# Altium schematic sheet ANALOG_INPUT_CTRL.SchDoc: Analog Input Control
size A3; DocumentNumber: 4; SheetNumber: 4; SheetTotal: 12
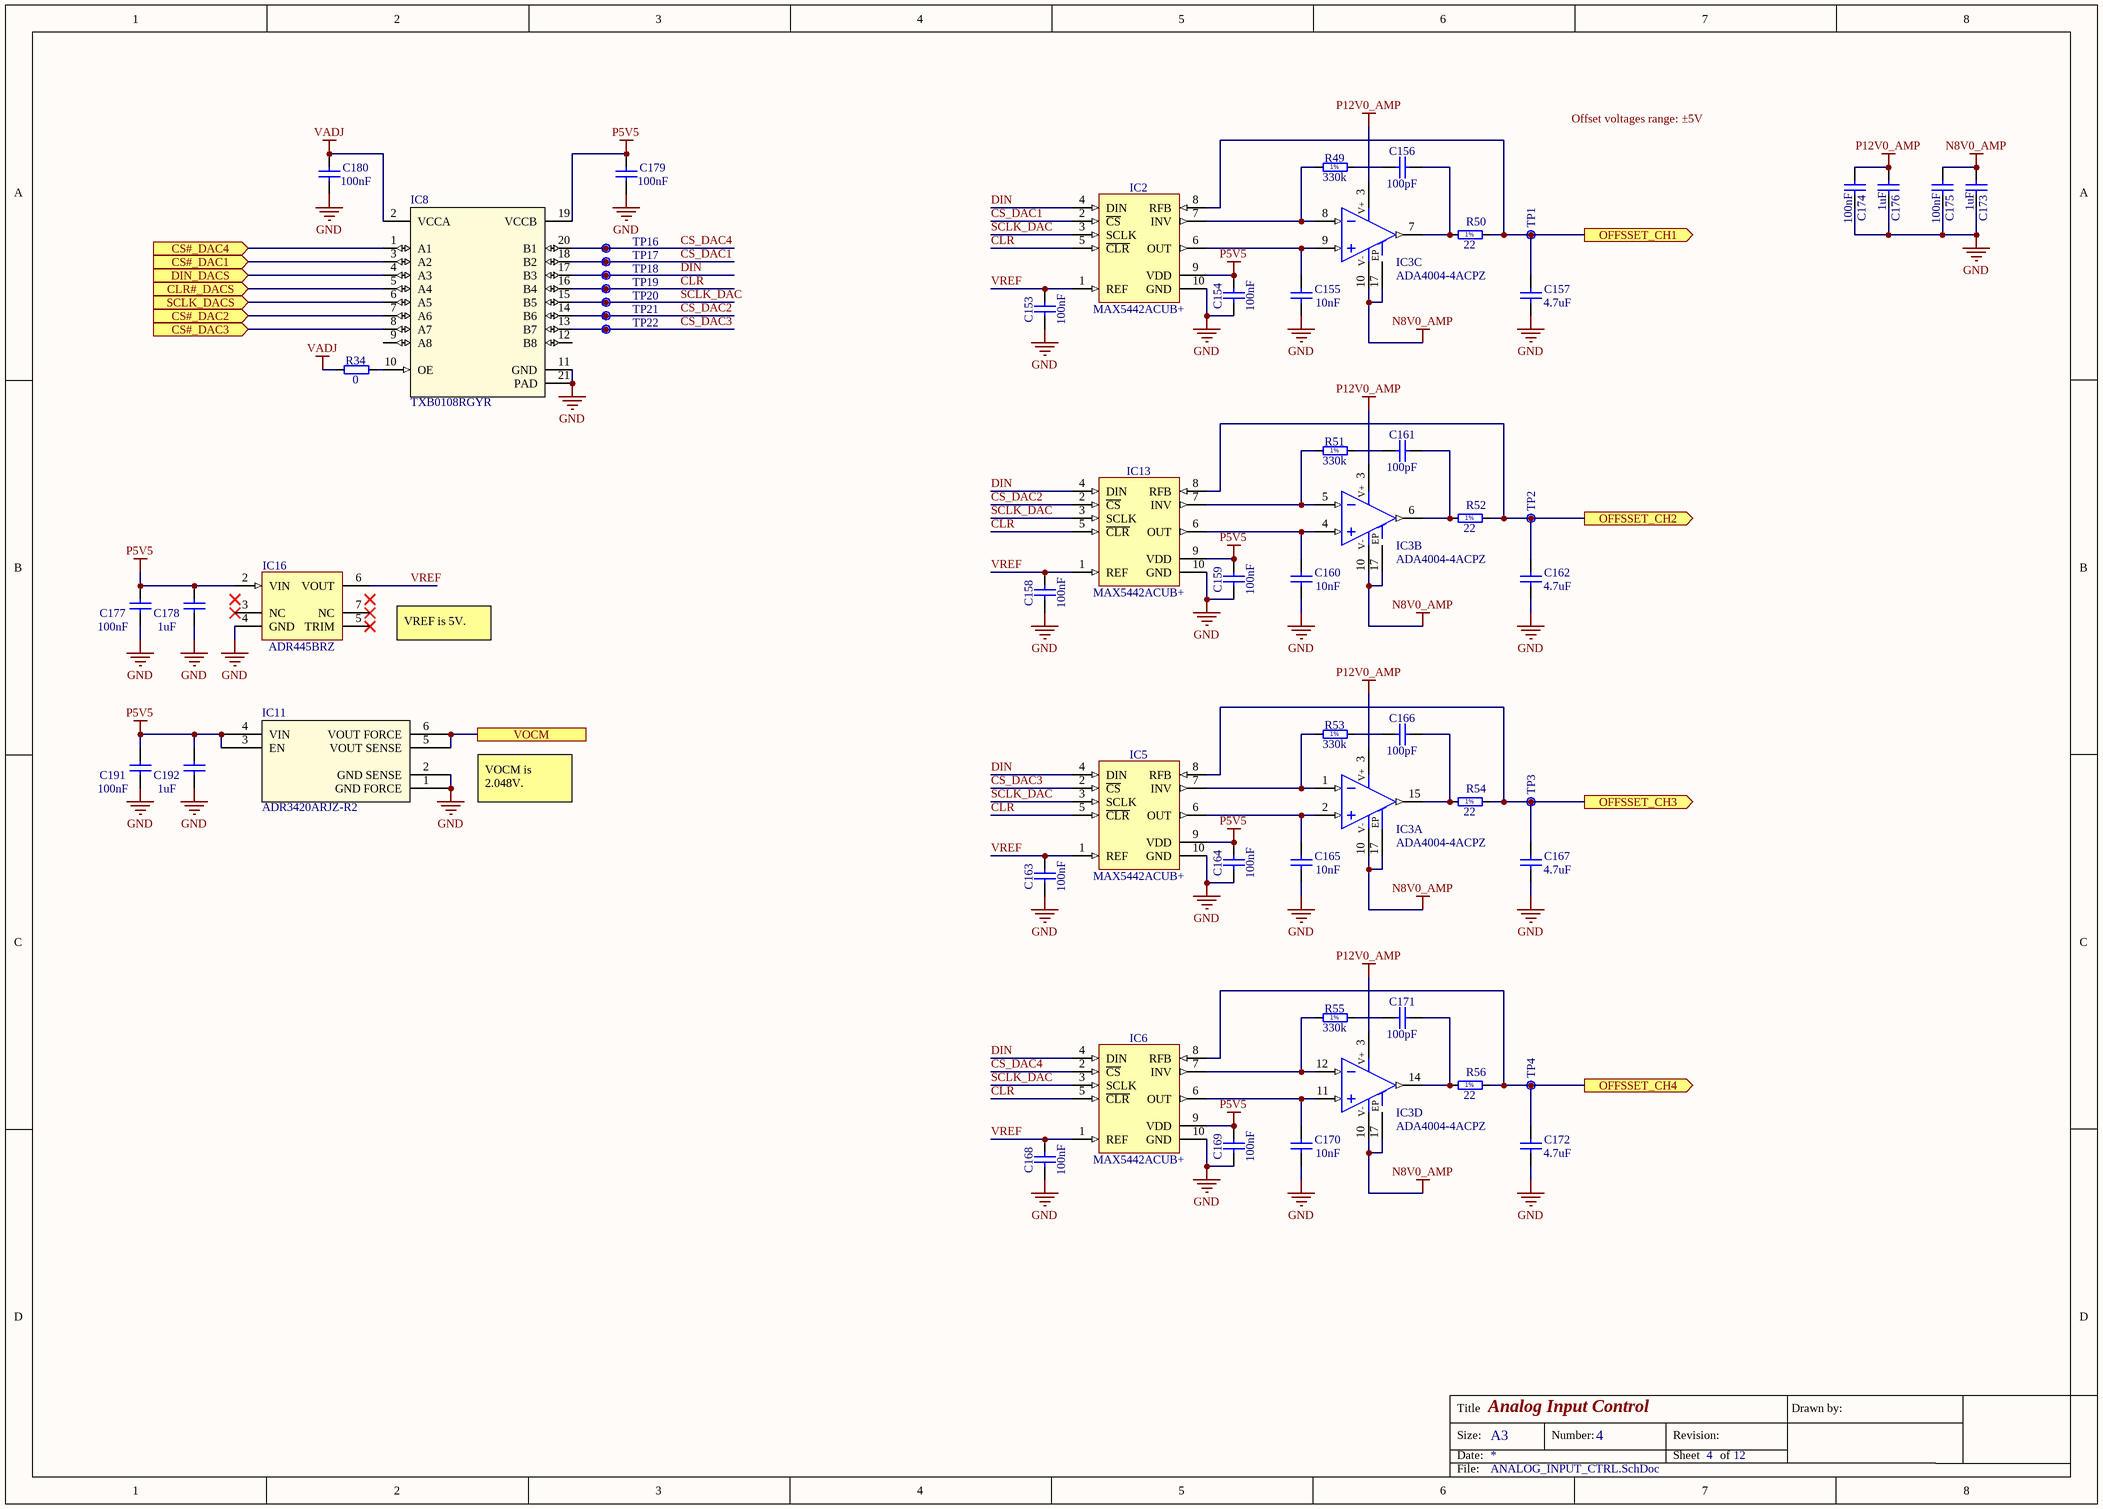
[diagram p0: ANALOG_INPUT_CTRL.SchDoc]

## Parts
C153  100nF  [CAPC1005X55N]
C154  100nF  [CAPC1005X55N]
C155  10nF  [CAPC1608X87N]
C156  100pF  [CAPC1608X87N]
C157  4.7uF  [CAPC2012X135N]
C158  100nF  [CAPC1005X55N]
C159  100nF  [CAPC1005X55N]
C160  10nF  [CAPC1608X87N]
C161  100pF  [CAPC1608X87N]
C162  4.7uF  [CAPC2012X135N]
C163  100nF  [CAPC1005X55N]
C164  100nF  [CAPC1005X55N]
C165  10nF  [CAPC1608X87N]
C166  100pF  [CAPC1608X87N]
C167  4.7uF  [CAPC2012X135N]
C168  100nF  [CAPC1005X55N]
C169  100nF  [CAPC1005X55N]
C170  10nF  [CAPC1608X87N]
C171  100pF  [CAPC1608X87N]
C172  4.7uF  [CAPC2012X135N]
C173  1uF  [CAPC1608X87N]
C174  100nF  [CAPC1608X87N]
C175  100nF  [CAPC1608X87N]
C176  1uF  [CAPC1608X87N]
C177  100nF  [CAPC1005X55N]
C178  1uF  [CAPC1608X87N]
C179  100nF  [CAPC0603X33N]
C180  100nF  [CAPC0603X33N]
C191  100nF  [CAPC1005X55N]
C192  1uF  [CAPC1608X87N]
IC2  MAX5442ACUB+  [SOP50P490X110-10N]
IC3  ADA4004-4ACPZ  [QFN65P400X400X100-17N-S225]  (parts A,B,C,D of 4)
IC5  MAX5442ACUB+  [SOP50P490X110-10N]
IC6  MAX5442ACUB+  [SOP50P490X110-10N]
IC8  TXB0108RGYR  [RGY20_3P05x2P05]
IC11  ADR3420ARJZ-R2  [RJ_6]
IC13  MAX5442ACUB+  [SOP50P490X110-10N]
IC16  ADR445BRZ  [SOIC127P600X175-8N]
R34  0  [RESC1005X40N]
R49  330k  [RESC1608X55N]
R50  22  [RESC1608X55N]
R51  330k  [RESC1608X55N]
R52  22  [RESC1608X55N]
R53  330k  [RESC1608X55N]
R54  22  [RESC1608X55N]
R55  330k  [RESC1608X55N]
R56  22  [RESC1608X55N]
TP1  (no value)  [TPS127]
TP2  (no value)  [TPS127]
TP3  (no value)  [TPS127]
TP4  (no value)  [TPS127]
TP16  Test Point  [TPS62]  (value not drawn)
TP17  Test Point  [TPS62]  (value not drawn)
TP18  Test Point  [TPS62]  (value not drawn)
TP19  Test Point  [TPS62]  (value not drawn)
TP20  Test Point  [TPS62]  (value not drawn)
TP21  Test Point  [TPS62]  (value not drawn)
TP22  Test Point  [TPS62]  (value not drawn)

## Ports
CLR#_DACS (in), CS#_DAC1 (in), CS#_DAC2 (in), CS#_DAC3 (in), CS#_DAC4 (in), DIN_DACS (in), OFFSSET_CH1 (out), OFFSSET_CH2 (out), OFFSSET_CH3 (out), OFFSSET_CH4 (out), SCLK_DACS (in), VOCM

## Nets
GND: C153.1 C154.1 C155.1 C157.2 C158.1 C159.1 C160.1 C162.2 C163.1 C164.1 C165.1 C167.2 C168.1 C169.1 C170.1 C172.2 C173.2 C174.2 C175.2 C176.2 C177.1 C178.1 C179.1 C180.1 C191.1 C192.1 IC2.10(GND) IC5.10(GND) IC6.10(GND) IC8.11(GND) IC8.21(PAD) IC11.1(GND_FORCE) IC11.2(GND_SENSE) IC13.10(GND) IC16.4(GND)
N8V0_AMP: C173.1 C175.1 IC3.10(V-) IC3.17(EP)
P5V5: C154.2 C159.2 C164.2 C169.2 C177.2 C178.2 C179.2 C191.2 C192.2 IC2.9(VDD) IC5.9(VDD) IC6.9(VDD) IC8.19(VCCB) IC11.3(EN) IC11.4(VIN) IC13.9(VDD) IC16.2(VIN)
P12V0_AMP: C174.1 C176.1 IC3.3(V+)
VADJ: C180.2 IC8.2(VCCA) R34.1
CLR: IC2.5(~{CLR}) IC5.5(~{CLR}) IC6.5(~{CLR}) IC8.16(B4) IC13.5(~{CLR}) TP19.1
CLR#_DACS: IC8.5(A4) ; port CLR#_DACS
CS#_DAC1: IC8.3(A2) ; port CS#_DAC1
CS#_DAC2: IC8.7(A6) ; port CS#_DAC2
CS#_DAC3: IC8.8(A7) ; port CS#_DAC3
CS#_DAC4: IC8.1(A1) ; port CS#_DAC4
CS_DAC1: IC2.2(~{CS}) IC8.18(B2) TP17.1
CS_DAC2: IC8.14(B6) IC13.2(~{CS}) TP21.1
CS_DAC3: IC5.2(~{CS}) IC8.13(B7) TP22.1
CS_DAC4: IC6.2(~{CS}) IC8.20(B1) TP16.1
DIN: IC2.4(DIN) IC5.4(DIN) IC6.4(DIN) IC8.17(B3) IC13.4(DIN) TP18.1
DIN_DACS: IC8.4(A3) ; port DIN_DACS
OFFSSET_CH1: C157.1 IC2.8(RFB) R50.2 TP1.1 ; port OFFSSET_CH1
OFFSSET_CH2: C162.1 IC13.8(RFB) R52.2 TP2.1 ; port OFFSSET_CH2
OFFSSET_CH3: C167.1 IC5.8(RFB) R54.2 TP3.1 ; port OFFSSET_CH3
OFFSSET_CH4: C172.1 IC6.8(RFB) R56.2 TP4.1 ; port OFFSSET_CH4
SCLK_DAC: IC2.3(SCLK) IC5.3(SCLK) IC6.3(SCLK) IC8.15(B5) IC13.3(SCLK) TP20.1
SCLK_DACS: IC8.6(A5) ; port SCLK_DACS
VOCM: IC11.5(VOUT_SENSE) IC11.6(VOUT_FORCE) ; port VOCM
VREF: C153.2 C158.2 C163.2 C168.2 IC2.1(REF) IC5.1(REF) IC6.1(REF) IC13.1(REF) IC16.6(VOUT)
NetC155_2: C155.2 IC2.6(OUT) IC3.9(IN+)
NetC156_1: C156.1 R49.2
NetC156_2: C156.2 IC3.7(OUT) R50.1
NetC160_2: C160.2 IC3.4(IN+) IC13.6(OUT)
NetC161_1: C161.1 R51.2
NetC161_2: C161.2 IC3.6(OUT) R52.1
NetC165_2: C165.2 IC3.2(IN+) IC5.6(OUT)
NetC166_1: C166.1 R53.2
NetC166_2: C166.2 IC3.15(OUT) R54.1
NetC170_2: C170.2 IC3.11(IN+) IC6.6(OUT)
NetC171_1: C171.1 R55.2
NetC171_2: C171.2 IC3.14(OUT) R56.1
NetIC2_7: IC2.7(INV) IC3.8(IN-) R49.1
NetIC3_1: IC3.1(IN-) IC5.7(INV) R53.1
NetIC3_5: IC3.5(IN-) IC13.7(INV) R51.1
NetIC3_12: IC3.12(IN-) IC6.7(INV) R55.1
NetIC8_10: IC8.10(OE) R34.2

Not connected (* = marked no-connect by the designer): IC8 9(A8) 12(B8); IC16 3(NC)* 5(TRIM)* 7(NC)*

## Notes on the sheet
- Offset voltages range: ±5V
- VREF is 5V.
- VOCM is 2.048V.
- Title
- Size:
- Date:
- A3
- Number:
- Revision:
- Sheet
- of
- Drawn by:
- File:
- (in symbol R0603_22R_1%_0.1W_100PPM) 1%
- (in symbol R0603_330K_1%_0.1W_100PPM) 1%

## Library data of the parts
C153 C154 C158 C159 C163 C164 C168 C169 C177 C191 = CC0402_100NF_16V_10%_X7R: Non-polarised capacitor; Part Description: SMD Multilayer Chip Ceramic Capacitor; Manufacturer: GENERIC; Manufacturer1 Part Number: GRM155R71C104KA88D; Voltage: 16V; TC: X7R; Tolerance: ±10%; Part Number: CC0402_100NF_16V_10%_X7R; Component Kind: Standard; Component Type: Standard; Pin Count: 2; Value: 100nF; Status: Not Recommended; Manufacturer Part Number: CC0402_100NF_16V_10%_X7R; Case: 0402; Mounted: Yes; Socket: No; SMD: Yes; Sense: No; Manufacturer1 Example: MURATA; Manufacturer1 ComponentHeight: 0.55mm; HelpURL: \\cern.ch\dfs\Applications\Altium\Datasheets\CC0402_X7R_MURATA_GRM.pdf; Author: CERN DEM JLC; CreateDate: 05.12.2013; LatestRevisionDate: 03.12.2007
C155 C160 C165 C170 = CC0603_10NF_50V_10%_X7R: Non-polarised capacitor; Manufacturer1 Part Number: 223858615636; Manufacturer: GENERIC; Part Description: SMD Multilayer Chip Ceramic Capacitor; TC: X7R; Tolerance: ±10%; Voltage: 50V; Author: CERN DEM JLC; Case: 0603; Component Type: Standard; CreateDate: 03.12.2007; HelpURL: \\cern.ch\dfs\Applications\Altium\Datasheets\CC0603_X7R_PHYCOMP.pdf; LatestRevisionDate: 03.12.2007; Manufacturer1 ComponentHeight: 0.87mm; Manufacturer1 Example: PHYCOMP; Manufacturer Part Number: CC0603_10NF_50V_10%_X7R; Mounted: Yes; Pin Count: 2; SMD: Yes; Socket: No; Status: Preferred; Value: 10nF; Part Number: CC0603_10NF_50V_10%_X7R; Component Kind: Standard; Sense: No
C156 C161 C166 C171 = CC0603_100PF_50V_5%_NP0: Non-polarised capacitor; Part Description: SMD Multilayer Chip Ceramic Capacitor; Manufacturer: GENERIC; Manufacturer1 Part Number: 223886715101; Voltage: 50V; TC: C0G/NP0; Tolerance: ±5%; Part Number: CC0603_100PF_50V_5%_NP0; Component Kind: Standard; Component Type: Standard; Pin Count: 2; Value: 100pF; Status: Preferred; Manufacturer Part Number: CC0603_100PF_50V_5%_NP0; Case: 0603; Mounted: Yes; Socket: No; SMD: Yes; Manufacturer1 Example: PHYCOMP; Manufacturer1 ComponentHeight: 0.87mm; HelpURL: \\cern.ch\dfs\Applications\Altium\Datasheets\CC0603_NP0_PHYCOMP.pdf; Author: CERN DEM JLC; CreateDate: 03.12.2007; LatestRevisionDate: 03.12.2007; Sense: No
C157 C162 C167 C172 = CC0805_4.7UF_16V_10%_X7R: Non-polarised capacitor; Part Description: SMD Multilayer Chip Ceramic Capacitor; Manufacturer: GENERIC; Manufacturer1 Part Number: EMK212B7475KG-T; Voltage: 16V; TC: X7R; Tolerance: ±10%; Part Number: CC0805_4.7UF_16V_10%_X7R; Component Kind: Standard; Component Type: Standard; Pin Count: 2; Value: 4.7uF; Status: Preferred; Manufacturer Part Number: CC0805_4.7UF_16V_10%_X7R; Case: 0805; Mounted: Yes; Socket: No; SMD: Yes; Sense: No; Manufacturer1 Example: TAIYO YUDEN; Manufacturer1 ComponentHeight: 1.35mm; HelpURL: \\cern.ch\dfs\Applications\Altium\Datasheets\CC0805_X7R_TAIYO-YUDEN_HIGH-VALUE.pdf; Author: CERN DEM JLC; CreateDate: 16.09.2014; LatestRevisionDate: 16.09.2014
C173 C176 = CC0603_1UF_16V_10%_X7R: Non-polarised capacitor; Part Description: SMD Multilayer Chip Ceramic Capacitor; Manufacturer: GENERIC; Manufacturer1 Part Number: 223878615663; Voltage: 16V; TC: X7R; Tolerance: ±10%; Part Number: CC0603_1UF_16V_10%_X7R; Value: 1uF; Component Kind: Standard; Component Type: Standard; Pin Count: 2; Status: None; Manufacturer Part Number: CC0603_1uF_16V_10%_X7R; Case: 0603; Mounted: Yes; Socket: No; SMD: Yes; Sense: No; Manufacturer1 Example: YAGEO PHYCOMP; Manufacturer1 ComponentHeight: 0.9mm; HelpURL: \\cern.ch\dfs\Applications\Altium\Datasheets\CC0603_X7R_PHYCOMP.pdf; Author: CERN DEM JLC; CreateDate: 03.12.2007; LatestRevisionDate: 17.04.2015
C174 C175 = CC0603_100NF_50V_10%_X7R: Non-polarised capacitor; Part Description: SMD Multilayer Chip Ceramic Capacitor; Manufacturer: GENERIC; Manufacturer1 Part Number: 223858615649; Voltage: 50V; TC: X7R; Tolerance: ±10%; Part Number: CC0603_100NF_50V_10%_X7R; Value: 100nF; Component Kind: Standard; Component Type: Standard; Pin Count: 2; Status: Preferred; Manufacturer Part Number: CC0603_100NF_50V_10%_X7R; Case: 0603; Mounted: Yes; Socket: No; SMD: Yes; Sense: No; Manufacturer1 Example: PHYCOMP; Manufacturer1 ComponentHeight: 0.87mm; HelpURL: \\cern.ch\dfs\Applications\Altium\Datasheets\CC0603_X7R_PHYCOMP.pdf; Author: CERN DEM JLC; CreateDate: 03.12.2007; LatestRevisionDate: 03.12.2007
C178 C192 = CC0603_1UF_16V_10%_X7R: Non-polarised capacitor; Manufacturer1 Part Number: 223878615663; Manufacturer: GENERIC; Part Description: SMD Multilayer Chip Ceramic Capacitor; TC: X7R; Tolerance: ±10%; Voltage: 16V; Author: CERN DEM JLC; Case: 0603; Component Type: Standard; CreateDate: 03.12.2007; HelpURL: \\cern.ch\dfs\Applications\Altium\Datasheets\CC0603_X7R_PHYCOMP.pdf; LatestRevisionDate: 17.04.2015; Manufacturer1 ComponentHeight: 0.9mm; Manufacturer1 Example: YAGEO PHYCOMP; Manufacturer Part Number: CC0603_1uF_16V_10%_X7R; Mounted: Yes; Pin Count: 2; SMD: Yes; Socket: No; Status: None; Value: 1uF; Part Number: CC0603_1UF_16V_10%_X7R; Component Kind: Standard; Sense: No
C179 C180 = CC0201_100NF_6.3V_10%_X5R: Non-polarised capacitor; Part Description: SMD Multilayer Chip Ceramic Capacitor; Manufacturer: GENERIC; Manufacturer1 Part Number: 02016D104KAT2A; Tolerance: ±10%; Voltage: 6.3V; TC: X5R; Value: 100nF; Part Number: CC0201_100NF_6.3V_10%_X5R; Component Kind: Standard; Component Type: Standard; Pin Count: 2; Status: Not Recommended; Manufacturer Part Number: CC0201_100NF_6.3V_10%_X5R; Case: 0201; Mounted: Yes; Socket: No; SMD: Yes; Sense: No; Manufacturer1 Example: AVX; Manufacturer1 ComponentHeight: 0.33mm; HelpURL: \\cern.ch\dfs\Applications\Altium\Datasheets\CC0201_X5R_AVX.pdf; Author: CERN DEM JLC; CreateDate: 03.12.2007; LatestRevisionDate: 03.12.2007
IC2 IC5 IC6 IC13 = MAX5442ACUB+: +5V, Serial-Input, Voltage-Output, 16-Bit ±2LSB DAC; Manufacturer: MAXIM; PressFit: No; Bonding: No; Part Number: MAX5442ACUB+; Component Kind: Standard; Component Type: Standard; Device: MAX5442ACUB+; PackageDescription: TSSOP, 10-Leads, Body 3.2x3.2mm (max), Pitch 0.50mm, IPC Medium Density; Part Description: +5V, Serial-Input, Voltage-Output, 16-Bit ±2LSB DAC; Manufacturer Part Number: MAX5442ACUB+; Pin Count: 10; Case: MSOP10; Mounted: Yes; Socket: No; SMD: Yes; ComponentHeight: 1.1mm; Author: CERN DEM JLC; HelpURL: \\cern.ch\dfs\Applications\Altium\Datasheets\MAX5442ACUB+.pdf; CreateDate: 12.01.2010; LatestRevisionDate: 12.01.2010; Sense: No
IC3 = ADA4004-4ACPZ: Quad Operational Amplifier; Part Description: 1.8nV/sqrt Hz, 36V Precision Amplifiers; Manufacturer: ANALOG DEVICES; PressFit: No; Bonding: No; Part Number: ADA4004-4ACPZ; Component Kind: Standard; Component Type: Standard; Device: ADA4004-4ACPZ; PackageDescription: QFN, 0.65mm pitch,square; 4 pin X 4 pin, 4mm X 4mm X 1mm H body (w/thermal tab 2.25 X 2.25mm),  IPC Medium Density; Manufacturer Part Number: ADA4004-4ACPZ; Pin Count: 14; Case: QFN16; Mounted: Yes; Socket: No; SMD: Yes; Sense: No; ComponentHeight: 1.75mm; Author: CERN DEM JLC; HelpURL: \\cern.ch\dfs\Applications\Altium\Datasheets\ADA4004-4ACPZ.pdf; CreateDate: 13.01.2010; LatestRevisionDate: 09.02.2010
IC8 = TXB0108RGYR: 8-Bit Bidirectional Voltage-Level Translator with Auto-Direction Sensing; Manufacturer: Texas Instruments; Application_BuildNumber: *; PackageReference: RGY0020A; RoHS: Y; Manufacturer Part Number: TXB0108RGYR
IC11 = ADR3420ARJZ-R2: Micropower, High Accuracy Voltage References - 2.048V; Manufacturer: Analog Devices; Manufacturer Part Number: ADR3420ARJZ-R2
IC16 = ADR445BRZ: 5V Ultralow Noise, LDO XFET Voltage References with Current Sink and Source; Part Description: 5V Output, ±2mV ±0.04% Accuracy, 3ppm/°C Ultralow Noise, LDO XFET Voltage References with Current Sink and Source; Manufacturer: ANALOG DEVICES; PressFit: No; Bonding: No; Part Number: ADR445BRZ; Component Kind: Standard; Component Type: Standard; Device: ADR445BRZ; PackageDescription: SOIC 8, Pitch 1.27mm, Body 4x5mm, IPC Medium Density; Manufacturer Part Number: ADR445BRZ; Pin Count: 5; Case: SOIC8; Mounted: Yes; Socket: No; SMD: Yes; ComponentHeight: 1.75mm; HelpURL: \\cern.ch\dfs\Applications\Altium\Datasheets\ADR445BRZ.pdf; Author: CERN DEM JLC; CreateDate: 08.03.2010; LatestRevisionDate: 08.03.2010; Sense: No
R34 = R0402_0R_JUMPER: Resistor; Part Description: 1A (0.05R Max DC Resistance) Zero Ohm Jumper; Manufacturer: GENERIC; Manufacturer1 Part Number: 232270591001L; Part Number: R0402_0R_JUMPER; Component Kind: Standard; Component Type: Standard; Pin Count: 2; Value: 0; Status: Not recommended; Manufacturer Part Number: R0402_0R_JUMPER; Case: 0402; Mounted: Yes; Sense: No; Socket: No; SMD: Yes; Manufacturer1 Example: YAGEO PHYCOMP; Manufacturer1 ComponentHeight: 0.4mm; HelpURL: \\cern.ch\dfs\Applications\Altium\Datasheets\R0402_Phycomp_RC0402.pdf; Author: CERN DEM JLC; CreateDate: 03.12.2007; LatestRevisionDate: 17.10.2012
R49 R51 R53 R55 = R0603_330K_1%_0.1W_100PPM: Resistor - 1%; Part Description: General Purpose Thick Film Chip Resistor; Manufacturer: GENERIC; Manufacturer1 Part Number: NRC06F3303TRF; Power: 0.1W; TC: ±100ppm/°C; Part Number: R0603_330K_1%_0.1W_100PPM; Component Kind: Standard; Component Type: Standard; Pin Count: 2; Value: 330k; Status: Preferred; Tolerance: ±1%; Manufacturer Part Number: R0603_330K_1%_0.1W_100PPM; Case: 0603; Mounted: Yes; Socket: No; SMD: Yes; Manufacturer1 Example: NIC COMPONENT; Manufacturer1 ComponentHeight: 0.55mm; HelpURL: \\cern.ch\dfs\Applications\Altium\Datasheets\R0603_NIC_NRC.pdf; Author: CERN DEM JLC; CreateDate: 03.12.2007; LatestRevisionDate: 13.03.2008; Sense: No
R50 R52 R54 R56 = R0603_22R_1%_0.1W_100PPM: Resistor - 1%; Manufacturer1 Part Number: NRC06F22R0TRF; Manufacturer: GENERIC; Part Description: General Purpose Thick Film Chip Resistor; Power: 0.1W; TC: ±100ppm/°C; Author: CERN DEM JLC; Case: 0603; Component Type: Standard; CreateDate: 03.12.2007; HelpURL: \\cern.ch\dfs\Applications\Altium\Datasheets\R0603_NIC_NRC.pdf; LatestRevisionDate: 13.03.2008; Manufacturer1 ComponentHeight: 0.55mm; Manufacturer1 Example: NIC COMPONENT; Manufacturer Part Number: R0603_22R_1%_0.1W_100PPM; Mounted: Yes; Pin Count: 2; SMD: Yes; Socket: No; Status: Preferred; Tolerance: ±1%; Value: 22; Part Number: R0603_22R_1%_0.1W_100PPM; Component Kind: Standard; Sense: No
TP1-TP4 = SMD_PAD_1.27X1.27MM: Test Point; Part Description: 1.27mm x 1.27mm PCB Copper Area (SMD Test Point); Mounted: No; Part Number: SMD_PAD_1.27X1.27MM; Component Kind: Standard (No BOM); Component Type: Standard (No BOM); Pin Count: 1; Family: Test Point; Socket: No; SMD: Yes; Sense: No; Status: None; ComponentHeight: 0mm; HelpURL: Undefined; Author: CERN DEM JLC; CreateDate: 12.01.2008; LatestRevisionDate: 12.01.2008; PackageDescription: 1.27mm x 1.27mm PCB Copper Area (SMD Test Point)
TP16-TP22 = SMD_PAD_0.62X0.62MM: Part Description: 0.62mm x 0.62mm PCB Copper Area (SMD Test Point); Mounted: No; Part Number: SMD_PAD_0.62X0.62MM; Component Kind: Standard (No BOM); Component Type: Standard (No BOM); Pin Count: 1; Family: Test Point; Socket: No; SMD: Yes; Sense: No; Status: None; ComponentHeight: 0mm; HelpURL: Undefined; Author: CERN DEM JLC; CreateDate: 12.01.2008; LatestRevisionDate: 12.01.2008; PackageDescription: 0.62mm x 0.62mm PCB Copper Area (SMD Test Point)